# EAGLE schematic main (EAGLE 9.5.1)
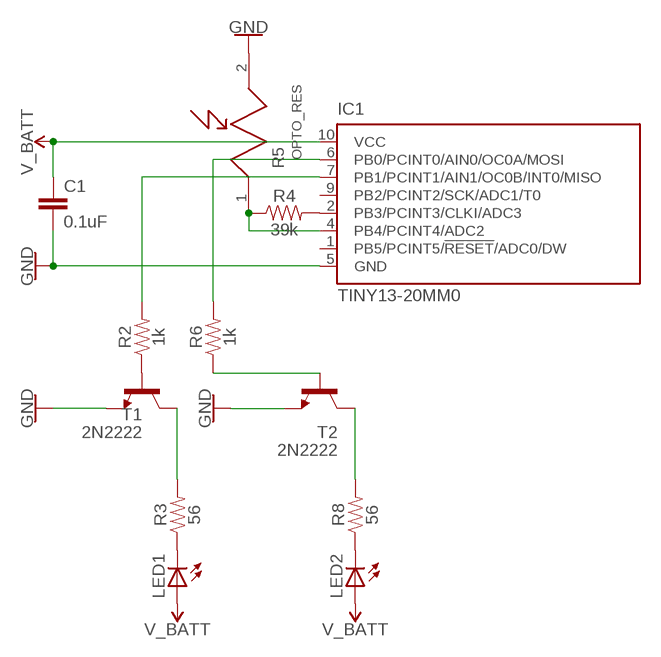
[diagram p0: schematic, sheet 1]

## Parts
C1  0.1uF  0.1UF-KIT-EZ-50V-20%  [CAP-PTH-SMALL-KIT]
IC1  TINY13-20MM0  [10M1]
LED1  LEDTOPLED-SANTANA  [MINI-TOPLED-SANTANA]
LED2  LEDTOPLED-SANTANA  [MINI-TOPLED-SANTANA]
R2  1k  RESISTOR0805  [0805]
R3  56  RESISTOR0805  [0805]
R4  39k  RESISTOR0805  [0805]
R5  OPTO_RES  [OPTO_RES]
R6  1k  RESISTOR0805  [0805]
R8  56  RESISTOR0805  [0805]
T1  2N2222  [TO92-EBC-OVAL]
T2  2N2222  [TO92-EBC-OVAL]

## Nets
GND: C1.2 IC1.5(GND) R5.2 T1.E T2.E
N$1: IC1.6(PB0/PCINT0/AIN0/OC0A/MOSI) R6.2
N$2: R2.1 T1.B
N$3: R6.1 T2.B
N$4: IC1.7(PB1/PCINT1/AIN1/OC0B/INT0/MISO) R2.2
N$5: LED1.C R3.1
N$6: LED2.C R8.1
N$7: R3.2 T1.C
N$8: R8.2 T2.C
N$9: IC1.2(PB3/PCINT3/CLKI/ADC3) R4.2
N$10: IC1.4(PB4/PCINT4/ADC2) R4.1 R5.1
V_BATT: C1.1 IC1.10(VCC) LED1.A LED2.A
Unconnected: IC1.1(PB5/PCINT5/!RESET!/ADC0/DW) IC1.9(PB2/PCINT2/SCK/ADC1/T0)

## Power pins joined to a net without a drawn wire
GND: IC1.11(GND)

## Library data of the parts
C1 = SparkFun-Capacitors:0.1UF: 0.1µF ceramic capacitors A capacitor is a passive two-terminal electrical component used to store electrical energy temporarily in an electric field.; PROD_ID: CAP-08370
IC1 = atmel:TINY13*: 8-bit AVR Microcontroller with 1K Bytes In-System Programmable Flash Source: http://www.atmel.com/dyn/resources/prod_documents/2535S.pdf; MPN: ATTINY13A-MMU; OC_FARNELL: 1715516; OC_NEWARK: 15R0298
LED1 LED2 = adafruit:LED: LED OSRAM: - CHIPLED LG R971, LG N971, LY N971, LG Q971, LY Q971, LO R971, LY R971 LH N974, LH R974 LS Q976, LO Q976, LY Q976 LO Q996 - Hyper CHIPLED LW Q18S LB Q993, LB Q99A, LB R99A - SideLED LS A670, LO A670, LY A670, LG A670, LP A670 LB A673, LV A673, LT A673, LW A673 LH A674 LY A675 LS A676, LA A676, LO A676, LY A676, LW A676 LS A679, LY A679, LG A679 - Hyper Micro SIDELED® LS Y876, LA Y876, LO Y876, LY Y876 LT Y87S - SmartLED LW L88C, LW L88S LB L89C, LB L89S, LG L890 LS L89K, LO L89K, LY L89K LS L896, LA L896, LO L896, LY L896 - TOPLED LS T670, LO T670, LY T670, LG T670, LP T670 LSG T670, LSP T670, LSY T670, LOP T670, LYG T670 LG T671, LOG T671, LSG T671 LB T673, LV T673, LT T673, LW T673 LH T674 LS T676, LA T676, LO T676, LY T676, LB T676, LH T676, LSB T676, LW T676 LB T67C, LV T67C, LT T67C, LS T67K, LO T67K, LY T67K, LW E67C LS E67B, LA E67B, LO E67B, LY E67B, LB E67C, LV E67C, LT E67C LW T67C LS T679, LY T679, LG T679 LS T770, LO T770, LY T770, LG T770, LP T770 LB T773, LV T773, LT T773, LW T773 LH T774 LS E675, LA E675, LY E675, LS T675 LS T776, LA T776, LO T776, LY T776, LB T776 LHGB T686 LT T68C, LB T68C - Hyper Mini TOPLED® LB M676 - Mini TOPLED Santana® LG M470 LS M47K, LO M47K, LY M47K Source: http://www.osram.convergy.de/
R2-R4 R6 R8 = SparkFun-Resistors:RESISTOR: Generic Resistor Package
R5 = opto-resistor:OPTO_RES
T1 T2 = adafruit:2N2222: NPN TRANSISTOR Big oval pads